# Altium schematic sheet RTC I2C DS1338Z-3.SchDoc
size 90 x 69 mm
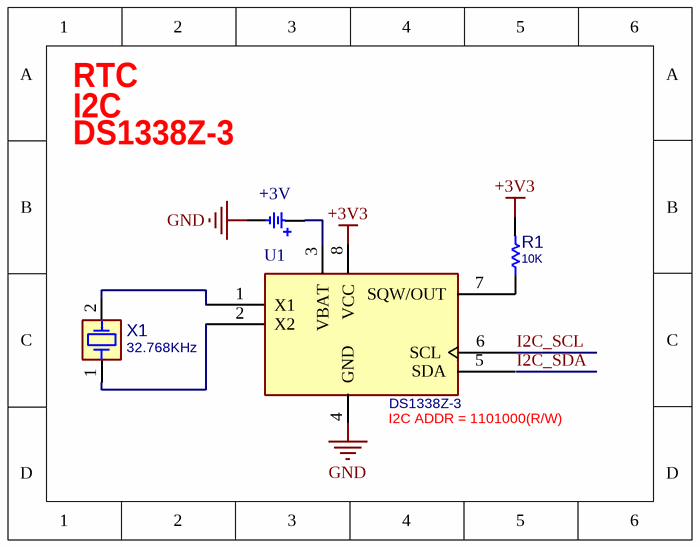
[diagram p0: RTC I2C DS1338Z-3.SchDoc]

## Parts
BT1  +3V  [BTH1220]
R1  10K  [R0603S]
U1  DS1338  [SO_8]  (value not drawn)
X1  32.768KHz  [XTL_2_3215]

## Nets
+3V3: R1.2 U1.8(VCC)
GND: BT1.2 U1.4(GND)
I2C_SCL: U1.6(SCL)
NetBT1_1: BT1.1 U1.3(VBAT)
NetR1_1: R1.1 U1.7(SQW/OUT)
NetU1_1: U1.1(X1) X1.2
NetU1_2: U1.2(X2) X1.1

Not connected (* = marked no-connect by the designer): U1 5(SDA)

## Notes on the sheet
- RTC
- I2C
- (near BT1) DS1338Z-3
- (near U1) I2C ADDR = 1101000(R/W)
- (in symbol RTC_I2C_DS1338Z-3_SOP8) DS1338Z-3

## Library data of the parts
BT1 = BATH_CR1220: BATTERY HOLDER, CR1220; VALUE: +3V; MANF_P#: -
R1 = RES_SMD: RES, SMD; MANF_P#: RK73H1ETTP4701F; MANF: KOA SPEER; PARAM: 0.063W; DESC: DESCRIPTION; DIST#: MOUSER; PARAM2: 1%; ASSEMBLY: ASSEMBLY; PRICE: 100= 0.5$; VALUE: 10K
U1 = RTC_I2C_DS1338Z-3_SOP8: Real-Time Clock, I2C; MANF: Maxim Integrated; MANF_P#: DS1338Z-3+; PARAM2: 2.7~5.5VCC, 1.3~3.7VBAT; PARAM: I2C, 56B, Batt, -40~85oC; VALUE: DS1338; PRICE: 3.4$
X1 = XTL_32.768KHz: 32.768KHz SMT 3.2x1.5 FC-135R; MANF: DIODES; PARAM: 10PPM, -30~85oC; DESC: X1E000021036701; DIST#: MOUSER; PARAM2: 7pF, 40OhmESR; MANF_P#: FL400WFQA1; ASSEMBLY: ASSEMBLY; PRICE: 0.7$; VALUE: 32.768KHz